# Altium schematic sheet Énigme3_Potentiomètres.SchDoc
size Tabloid; Date: Date; Author: Author 1; DocumentNumber: 6; Revision: 1; SheetNumber: 6; SheetTotal: 7; Size: 11x17; Sheet_Name: Énigme3_Potentiomètre; SPICEModelCacheRTYEHROU: <root> / <DocumentId>RTYEHROU</DocumentId> / </root>
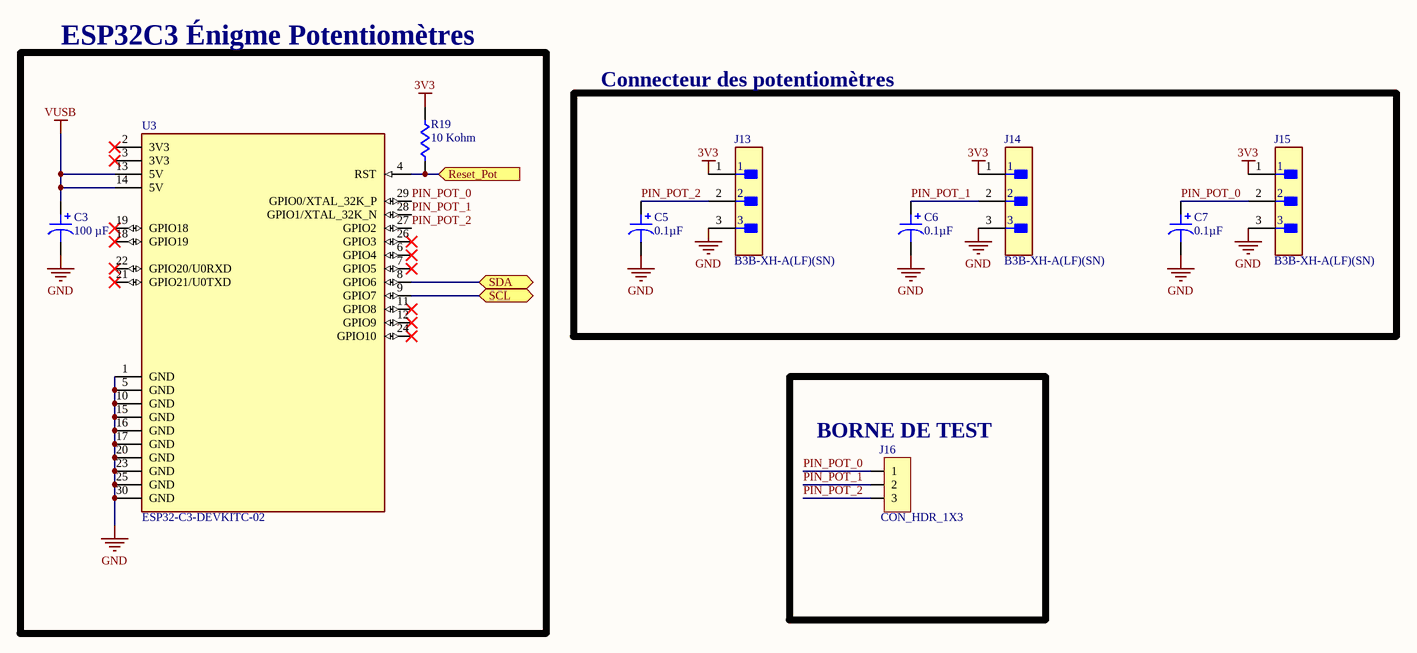
[diagram p0: Énigme3_Potentiomètres.SchDoc]

## Parts
C3  100 µF  [CAP AL TH D8 L3.5 H12.5]
C5  0.1µF  [CAP TH ALUM ELEC D5.00mm S2.00mm H12.00mm]
C6  0.1µF  [CAP TH ALUM ELEC D5.00mm S2.00mm H12.00mm]
C7  0.1µF  [CAP TH ALUM ELEC D5.00mm S2.00mm H12.00mm]
J13  B3B-XH-A(LF)(SN)  [FP-B3B-XH-A_LF_SN-MFG]
J14  B3B-XH-A(LF)(SN)  [FP-B3B-XH-A_LF_SN-MFG]
J15  B3B-XH-A(LF)(SN)  [FP-B3B-XH-A_LF_SN-MFG]
J16  CON_HDR_1X3  [CON_HDR_1x3]
R19  10 Kohm  [Res_Template]
U3  ESP32-C3-DEVKITC-02  [XCVR_ESP32-C3-DEVKITC-02]

## Blocks framed on the sheet
ESP32C3 Énigme Potentiomètres: C3 R19 U3
Connecteur des potentiomètres: C5-C7 J13-J15
BORNE DE TEST: J16

## Ports
Reset_Pot (in), SCL (bidir), SDA (bidir)

## Nets
3V3: J13.1 J14.1 J15.1 R19.2
GND: C3.2 C5.2 C6.2 C7.2 J13.3 J14.3 J15.3 U3.1(GND) U3.5(GND) U3.10(GND) U3.15(GND) U3.16(GND) U3.17(GND) U3.20(GND) U3.23(GND) U3.25(GND) U3.30(GND)
VUSB: C3.1 U3.13(5V) U3.14(5V)
PIN_POT_0: C7.1 J15.2 J16.1 U3.29(GPIO0/XTAL_32K_P)
PIN_POT_1: C6.1 J14.2 J16.2 U3.28(GPIO1/XTAL_32K_N)
PIN_POT_2: C5.1 J13.2 J16.3 U3.27(GPIO2)
Reset_Pot: R19.1 U3.4(RST) ; port Reset_Pot
SCL: U3.9(GPIO7) ; port SCL
SDA: U3.8(GPIO6) ; port SDA

Not connected (* = marked no-connect by the designer): U3 2(3V3)* 3(3V3)* 6(GPIO4)* 7(GPIO5)* 11(GPIO8)* 12(GPIO9)* 18(GPIO19)* 19(GPIO18)* 21(GPIO21/U0TXD)* 22(GPIO20/U0RXD)* 24(GPIO10)* 26(GPIO3)*

## Notes on the sheet
- Nom de la feuille
- Titre du projet
- Cours associé au projet
- Taille
- Département
- Technologies du
- Révision
- PCB
- .
- SCH
- Date
- génie électrique
- Feuille
- Variant
- de
- Concepteurs

## Library data of the parts
C3 = 860020674015: CAP ALUM 100UF 20% 50V RADIAL; manufacturer: Würth Elektronik; Lifetime @ Temp.: 2000 Hrs @ 105°C; Polarization: Polar; Ripple Current @ High Frequency: 306 mA @ 100 kHz; Ripple Current @ Low Frequency: 200 mA @ 120 Hz; Part Number: 860020674015; Applications: General Purpose; Capacitance: 100 µF; componentlink1description: Datasheet; componentlink1url: https://katalog.we-online.de/pbs/datasheet/860020674015.pdf; componentlink2description: DigiKey Link; componentlink2url: https://www.digikey.com/en/products/detail/würth-elektronik/860020674015/5727098; Device Package: Radial, Can; Height - Seated (Max): 0.492" (12.50mm); lastupdated: 2024-06-03 20:06:11; Lead Spacing: 0.138" (3.50mm); Lifecycle Status: Active; Minimum Order: 1; Mounting Type: Through Hole; Operating Temperature: -40°C ~ 105°C; Package / Case: Radial, Can; packaging: TapeAndBox; partid: 7238; Part Status: Active; price: 0.16; series: WCAP-ATG5; Size / Dimension: 0.315" Dia (8.00mm); Supplier 1: DigiKey; Supplier Part Number 1: 732-8861-1-ND; Tolerance: ±20%; value: 100 µF; Voltage - Rated: 50 V
C5-C7 = UKL2A0R1KDD: CAP ALUM 0.1UF 10% 100V RADIAL; manufacturer: Nichicon; Lifetime @ Temp.: 2000 Hrs @ 85°C; Polarization: Polar; Ripple Current @ High Frequency: 4.2mA @ 10kHz; Ripple Current @ Low Frequency: 2.1mA @ 120Hz; Part Number: UKL2A0R1KDD; Applications: General Purpose; Capacitance: 0.1µF; componentlink1description: Datasheet; componentlink1url: http://nichicon-us.com/english/products/pdfs/e-ukl.pdf; componentlink2description: DigiKey Link; componentlink2url: http://digikey.com/product-detail/en/nichicon/UKL2A0R1KDD/493-16876-ND/2598554; Device Package: Radial, Can; Height - Seated (Max): 0.472" (12.00mm); lastupdated: 2020-09-04 23:28:57; Lead Spacing: 0.079" (2.00mm); Lifecycle Status: Active; Minimum Order: 1; Mounting Type: Through Hole; Operating Temperature: -40°C ~ 85°C; Package / Case: Radial, Can; packaging: Bulk; partid: 21583; Part Status: Active; price: 0.39; series: UKL; Size / Dimension: 0.197" Dia (5.00mm); Supplier 1: DigiKey; Supplier Part Number 1: 493-16876-ND; Tolerance: ±10%; value: 0.1µF; Voltage - Rated: 100V
J13-J15 = CMP-17439-000014-3: CONN HEADER VERT 3POS 2.5MM; Max Voltage Rating (DC): 250V; Number of Positions: 3; Current Rating: 3A; Gender: Male; Wire/Cable Gauge: 22AWG; Contact Resistance: 20mR; Insulation Resistance: 1GR; Insulation Material: Nylon; Contact Plating: Tin; Depth: 5.75mm; Contact Type: Male Pin; Max Operating Temperature: 85°C; Insulation Color: Natural; Voltage Rating (AC): 250V; Color: Natural; Connector Type: Header; Orientation: Straight; Fastening Type: Detent; Housing Color: White; Min Operating Temperature: -25°C; Termination: Solder; Voltage Rating: 250V; Series: XH; Pitch: 2.5mm; Contact Shape: Square; Number of Rows: 1; Lead Free: Lead Free; Packaging: Bulk; Mount: Through Hole; Flammability Rating: UL94 V-0; Max Voltage Rating (AC): 250V; REACH SVHC: No SVHC; Housing Material: Polyamide; Contact Material: Brass; Lead Pitch: 2.5mm; Contact Finish - Mating: TIN; Length: 9.9mm; Max Current Rating: 3A; Number of Contacts: 3
J16 = CMP-005-000001-1: CON - Header 1x3 pins-100Mils - TH; Polarized: No; Source: CEGEP_SHERBROOKE_TGE_LIBRARY.SchLib; Component Type: Standard; Package: TH; Power Max: *; Pin Count: 3; Design Item ID: CON_HDR_1X3; Note: *; Manufacturer #1: *; HelpURL: *; Assembly Type: TH
R19 = 470 ohm: Custom Semiconductor Resistor
U3 = ESP32-C3-DEVKITC-02: Development Boards & Kits - Wireless (Engineering Samples) ESP32-C3 General-Purpose Development Board, embeds ESP32-C3-WROOM-02, 4 MB Flash, with Pin Header; MF: Espressif Systems; Purchase-URL: https://www.digikey.ca/en/products/detail/espressif-systems/ESP32-C3-DEVKITC-02/14553009?gclsrc=aw.ds&&utm_adgroup=&utm_source=google&utm_medium=cpc&utm_campaign=PMax%20Product_Low%20ROAS%20Categories&utm_term=&productid=14553009&utm_content=&utm_id=go_cmp-20291741422_adg-_ad-__dev-c_ext-_prd-14553009_sig-CjwKCAiAh6y9BhBREiwApBLHC_cF2gDRygapSaJLXU2Wdnx3_ghIaBBBCKe6dQeqHq45MeITmry7OBoCG4EQAvD_BwE&gad_source=1&gclid=CjwKCAiAh6y9BhBREiwApBLHC_cF2gDRygapSaJLXU2Wdnx3_ghIaBBBCKe6dQeqHq45MeITmry7OBoCG4EQAvD_BwE; Package: None; MP: ESP32-C3-DevKitC-02; Price: 12.94$; Availability: In Stock; SnapEDA_Link: https://www.snapeda.com/parts/ESP32-C3-DevKitC-02/Espressif+Systems/view-part/?ref=snap; Check_prices: https://www.snapeda.com/parts/ESP32-C3-DevKitC-02/Espressif+Systems/view-part/?ref=eda; ComponentLink1Description: New link; ComponentLink1URL: https://docs.espressif.com/projects/esp-idf/en/v5.2/esp32c3/hw-reference/esp32c3/user-guide-devkitc-02.html